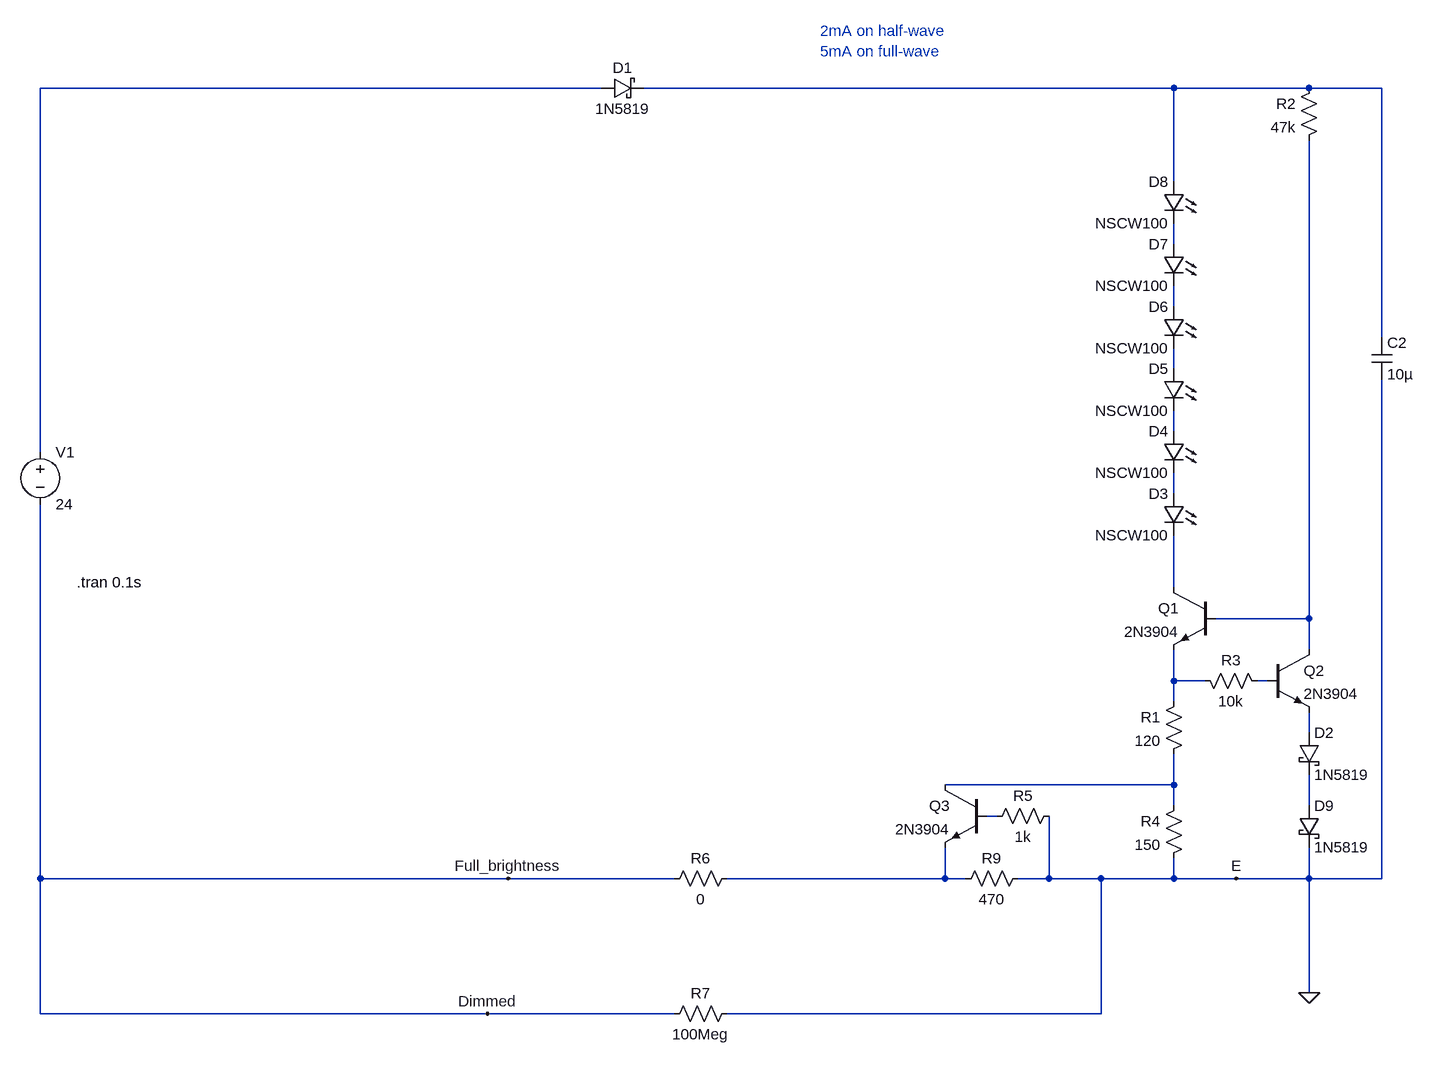
[diagram p0: schematic bridgedSense.asc]
bridgedSense.asc, the LTspice schematic file:
Version 4
SHEET 1 1768 976
WIRE 240 -496 -624 -496
WIRE 1120 -496 304 -496
WIRE 1328 -496 1120 -496
WIRE 1440 -496 1328 -496
WIRE 1120 -352 1120 -496
WIRE 1120 -256 1120 -288
WIRE 1120 -160 1120 -192
WIRE 1440 -112 1440 -496
WIRE 1120 -64 1120 -96
WIRE 1120 32 1120 0
WIRE -624 64 -624 -496
WIRE 1120 128 1120 96
WIRE 1120 272 1120 192
WIRE 1328 320 1328 -416
WIRE 1328 320 1184 320
WIRE 1328 368 1328 320
WIRE 1120 416 1120 368
WIRE 1168 416 1120 416
WIRE 1264 416 1248 416
WIRE 1120 448 1120 416
WIRE 1328 496 1328 464
WIRE 1120 576 1120 528
WIRE 1120 576 768 576
WIRE 1120 608 1120 576
WIRE 1328 608 1328 560
WIRE 848 624 832 624
WIRE -624 720 -624 144
WIRE 96 720 -624 720
WIRE 352 720 96 720
WIRE 768 720 768 672
WIRE 768 720 432 720
WIRE 800 720 768 720
WIRE 928 720 928 624
WIRE 928 720 880 720
WIRE 1008 720 928 720
WIRE 1120 720 1120 688
WIRE 1120 720 1008 720
WIRE 1216 720 1120 720
WIRE 1328 720 1328 672
WIRE 1328 720 1216 720
WIRE 1440 720 1440 -48
WIRE 1440 720 1328 720
WIRE 1328 896 1328 720
WIRE -624 928 -624 720
WIRE 64 928 -624 928
WIRE 352 928 64 928
WIRE 1008 928 1008 720
WIRE 1008 928 432 928
FLAG 1216 720 E
FLAG 1328 896 0
FLAG 96 720 Full_brightness
FLAG 64 928 Dimmed
SYMBOL voltage -624 48 R0
WINDOW 123 0 0 Left 0
WINDOW 39 0 0 Left 0
SYMATTR InstName V1
SYMATTR Value 24
SYMBOL schottky 240 -480 R270
WINDOW 0 32 32 VTop 2
WINDOW 3 0 32 VBottom 2
SYMATTR InstName D1
SYMATTR Value 1N5819
SYMATTR Description Diode
SYMATTR Type diode
SYMBOL LED 1136 128 M0
SYMATTR InstName D3
SYMATTR Value NSCW100
SYMATTR Description Diode
SYMATTR Type diode
SYMBOL npn 1184 272 M0
SYMATTR InstName Q1
SYMATTR Value 2N3904
SYMBOL res 1136 432 M0
SYMATTR InstName R1
SYMATTR Value 120
SYMBOL res 1344 -512 M0
SYMATTR InstName R2
SYMATTR Value 47k
SYMBOL npn 1264 368 R0
SYMATTR InstName Q2
SYMATTR Value 2N3904
SYMBOL res 1152 400 M90
WINDOW 0 0 56 VBottom 2
WINDOW 3 32 56 VTop 2
SYMATTR InstName R3
SYMATTR Value 10k
SYMBOL LED 1136 32 M0
SYMATTR InstName D4
SYMATTR Value NSCW100
SYMATTR Description Diode
SYMATTR Type diode
SYMBOL LED 1136 -64 M0
SYMATTR InstName D5
SYMATTR Value NSCW100
SYMATTR Description Diode
SYMATTR Type diode
SYMBOL LED 1136 -160 M0
SYMATTR InstName D6
SYMATTR Value NSCW100
SYMATTR Description Diode
SYMATTR Type diode
SYMBOL LED 1136 -256 M0
SYMATTR InstName D7
SYMATTR Value NSCW100
SYMATTR Description Diode
SYMATTR Type diode
SYMBOL LED 1136 -352 M0
SYMATTR InstName D8
SYMATTR Value NSCW100
SYMATTR Description Diode
SYMATTR Type diode
SYMBOL cap 1424 -112 R0
SYMATTR InstName C2
SYMATTR Value 10µ
SYMBOL res 1136 592 M0
SYMATTR InstName R4
SYMATTR Value 150
SYMBOL res 896 704 R90
WINDOW 0 0 56 VBottom 2
WINDOW 3 32 56 VTop 2
SYMATTR InstName R9
SYMATTR Value 470
SYMBOL npn 832 576 M0
SYMATTR InstName Q3
SYMATTR Value 2N3904
SYMBOL res 944 608 R90
WINDOW 0 0 56 VBottom 2
WINDOW 3 32 56 VTop 2
SYMATTR InstName R5
SYMATTR Value 1k
SYMBOL schottky 1312 496 R0
SYMATTR InstName D2
SYMATTR Value 1N5819
SYMATTR Description Diode
SYMATTR Type diode
SYMBOL schottky 1312 608 R0
SYMATTR InstName D9
SYMATTR Value 1N5819
SYMATTR Description Diode
SYMATTR Type diode
SYMBOL res 448 704 R90
WINDOW 0 0 56 VBottom 2
WINDOW 3 32 56 VTop 2
SYMATTR InstName R6
SYMATTR Value 0
SYMBOL res 448 912 R90
WINDOW 0 0 56 VBottom 2
WINDOW 3 32 56 VTop 2
SYMATTR InstName R7
SYMATTR Value 100Meg
TEXT -568 264 Left 2 !.tran 0.1s
TEXT 576 -584 Left 2 ;2mA on half-wave\n5mA on full-wave

The netlist it stands for:
* bridgedSense.asc
V1 N001 Dimmed 24
D1 N001 N002 1N5819
D3 N007 N008 NSCW100
Q1 N008 N009 N010 0 2N3904
R1 N010 N013 120
R2 N002 N009 47k
Q2 N009 N011 N012 0 2N3904
R3 N010 N011 10k
D4 N006 N007 NSCW100
D5 N005 N006 NSCW100
D6 N004 N005 NSCW100
D7 N003 N004 NSCW100
D8 N002 N003 NSCW100
C2 N002 0 10µ
R4 N013 0 150
R9 0 N016 470
Q3 N013 N015 N016 0 2N3904
R5 0 N015 1k
D2 N012 N014 1N5819
D9 N014 0 1N5819
R6 N016 Dimmed 0
R7 0 Dimmed 100Meg
.model D D
.lib standard.dio
.model NPN NPN
.model PNP PNP
.lib standard.bjt
.tran 0.1s
* 2mA on half-wave
* 5mA on full-wave
.backanno
.end